# EAGLE schematic RPi-XBee-SMT (EAGLE 6.2)
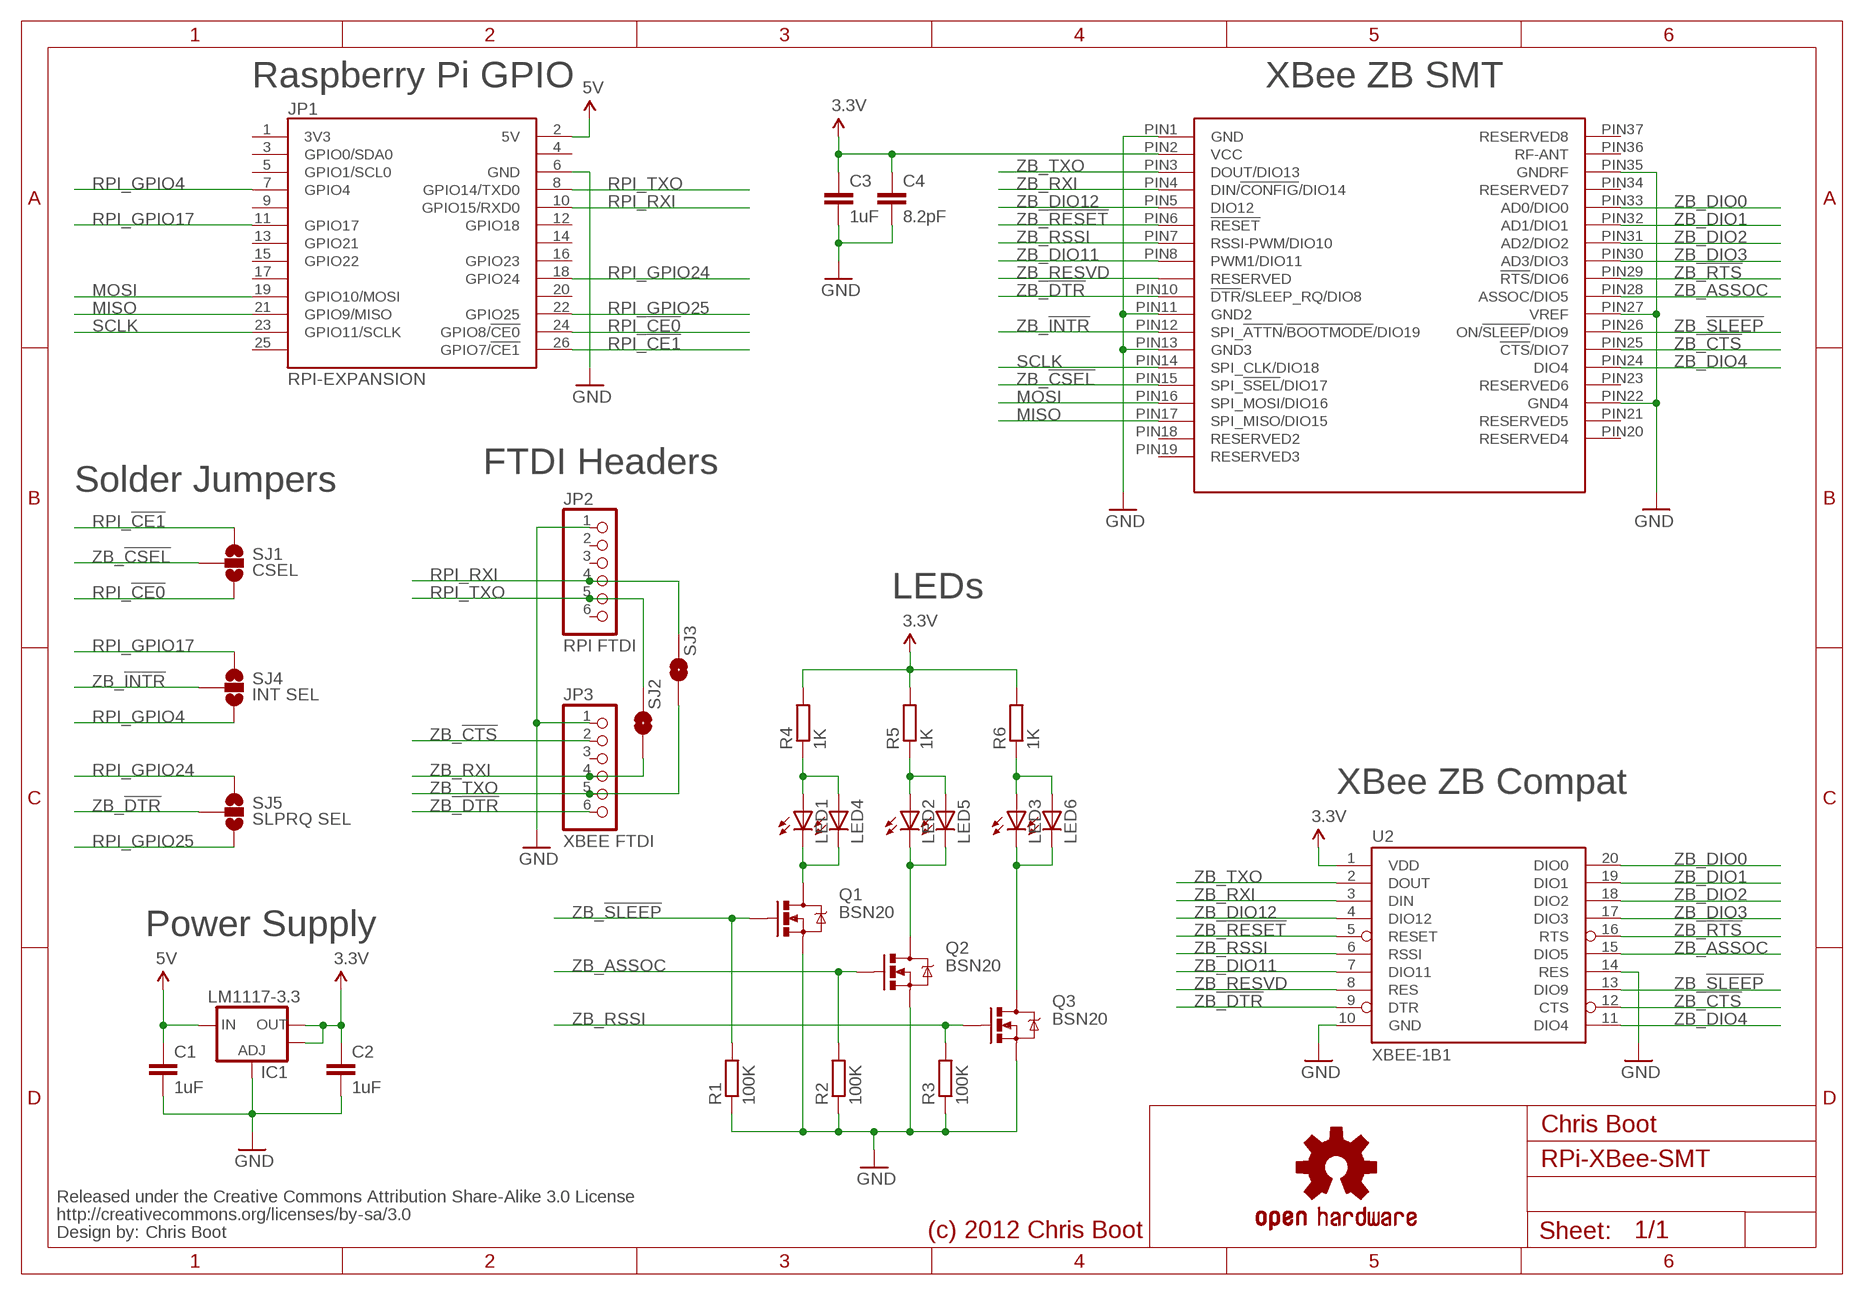
[diagram p0: schematic, sheet 1]

## Parts
C1  1uF  C-EUC0805  [C0805]
C2  1uF  C-EUC0805  [C0805]
C3  1uF  C-EUC0805  [C0805]
C4  8.2pF  C-EUC0805  [C0805]
IC1  LM1117-3.3  V_REG_LM1117SOT223  [SOT223]
JP1  RPI-EXPANSION  [2X13]
JP2  RPI FTDI  PINHD-1X6  [1X06]
JP3  XBEE FTDI  PINHD-1X6  [1X06]
LED1  LED-3MM-NO_SILK  [LED3MM-NS]
LED2  LED-3MM-NO_SILK  [LED3MM-NS]
LED3  LED-3MM-NO_SILK  [LED3MM-NS]
LED4  LED0603  [LED-0603]
LED5  LED0603  [LED-0603]
LED6  LED0603  [LED-0603]
Q1  BSN20  MOSFET-NCHANNELSMD  [SOT23-3]
Q2  BSN20  MOSFET-NCHANNELSMD  [SOT23-3]
Q3  BSN20  MOSFET-NCHANNELSMD  [SOT23-3]
R1  100K  R-EU_R0805  [R0805]
R2  100K  R-EU_R0805  [R0805]
R3  100K  R-EU_R0805  [R0805]
R4  1K  R-EU_R0805  [R0805]
R5  1K  R-EU_R0805  [R0805]
R6  1K  R-EU_R0805  [R0805]
SJ1  CSEL  SOLDERJUMPER_2WAYS  [SJ_3]
SJ2  SOLDERJUMPERNO  [SJ_2S-NO]
SJ3  SOLDERJUMPERNO  [SJ_2S-NO]
SJ4  INT SEL  SOLDERJUMPER_2WAYS  [SJ_3]
SJ5  SLPRQ SEL  SOLDERJUMPER_2WAYS  [SJ_3]
U1  QUBIQ_XBEE-SMT  [QUBIQ_FLAT-RF]
U2  XBEE-1B1  [XBEE-1]
U$3  CREATIVE_COMMONS  [CREATIVE_COMMONS]
U$4  OSHW-LOGOL  [OSHW-LOGO-L]

## Nets
3.3V: C2.1 C3.1 C4.1 IC1.2(OUT) IC1.4(OUT) R4.2 R5.2 R6.2 U1.PIN2(VCC) U2.1(VDD)
5V: C1.1 IC1.3(IN) JP1.2(5V)
GND: C1.2 C2.2 C3.2 C4.2 IC1.1(ADJ) JP1.6(GND) JP2.1 JP3.1 Q1.2(S) Q2.2(S) Q3.2(S) R1.1 R2.1 R3.1 U1.PIN1(GND) U1.PIN11(GND2) U1.PIN13(GND3) U1.PIN22(GND4) U1.PIN27(VREF) U1.PIN35(GNDRF) U2.10(GND) U2.14(RES)
MISO: JP1.21(GPIO9/MISO) U1.PIN17(SPI_MISO/DIO15)
MOSI: JP1.19(GPIO10/MOSI) U1.PIN16(SPI_MOSI/DIO16)
N$1: LED1.K(C) LED4.C Q1.3(D)
N$5: LED2.K(C) LED5.C Q2.3(D)
N$6: LED3.K(C) LED6.C Q3.3(D)
N$10: LED1.A LED4.A R4.1
N$12: LED2.A LED5.A R5.1
N$14: LED3.A LED6.A R6.1
RPI_!CE0: JP1.24(GPIO8/!CE0) SJ1.3
RPI_!CE1: JP1.26(GPIO7/!CE1) SJ1.1
RPI_GPIO4: JP1.7(GPIO4) SJ4.3
RPI_GPIO17: JP1.11(GPIO17) SJ4.1
RPI_GPIO24: JP1.18(GPIO24) SJ5.1
RPI_GPIO25: JP1.22(GPIO25) SJ5.3
RPI_RXI: JP1.10(GPIO15/RXD0) JP2.4 SJ3.2
RPI_TXO: JP1.8(GPIO14/TXD0) JP2.5 SJ2.2
SCLK: JP1.23(GPIO11/SCLK) U1.PIN14(SPI_CLK/DIO18)
ZB_!CSEL: SJ1.2 U1.PIN15(SPI_!SSEL!/DIO17)
ZB_!CTS: JP3.2 U1.PIN25(!CTS!/DIO7) U2.12(CTS)
ZB_!DTR: JP3.6 SJ5.2 U1.PIN10(!DTR!/SLEEP_RQ/DIO8) U2.9(DTR)
ZB_!INTR: SJ4.2 U1.PIN12(SPI_!ATTN!/!BOOTMODE!/DIO19)
ZB_!RESET: U1.PIN6(!RESET) U2.5(RESET)
ZB_!RTS: U1.PIN29(!RTS!/DIO6) U2.16(RTS)
ZB_!SLEEP: Q1.1(G) R1.2 U1.PIN26(ON/!SLEEP!/DIO9) U2.13(DIO9)
ZB_ASSOC: Q2.1(G) R2.2 U1.PIN28(ASSOC/DIO5) U2.15(DIO5)
ZB_DIO0: U1.PIN33(AD0/DIO0) U2.20(DIO0)
ZB_DIO1: U1.PIN32(AD1/DIO1) U2.19(DIO1)
ZB_DIO2: U1.PIN31(AD2/DIO2) U2.18(DIO2)
ZB_DIO3: U1.PIN30(AD3/DIO3) U2.17(DIO3)
ZB_DIO4: U1.PIN24(DIO4) U2.11(DIO4)
ZB_DIO11: U1.PIN8(PWM1/DIO11) U2.7(DIO11)
ZB_DIO12: U1.PIN5(DIO12) U2.4(DIO12)
ZB_RESVD: U1.PIN9(RESERVED) U2.8(RES)
ZB_RSSI: Q3.1(G) R3.2 U1.PIN7(RSSI-PWM/DIO10) U2.6(RSSI)
ZB_RXI: JP3.4 SJ2.1 U1.PIN4(DIN/!CONFIG!/DIO14) U2.3(DIN)
ZB_TXO: JP3.5 SJ3.1 U1.PIN3(DOUT/DIO13) U2.2(DOUT)
Unconnected: JP1.3(GPIO0/SDA0) JP1.4(NC0) JP1.5(GPIO1/SCL0) JP1.9(NC1) JP1.12(GPIO18) JP1.13(GPIO21) JP1.14(NC3) JP1.15(GPIO22) JP1.16(GPIO23) JP1.17(NC4) JP1.20(NC5) JP1.25(NC6) JP2.2 JP2.3 JP2.6 JP3.3 U1.PIN18(RESERVED2) U1.PIN19(RESERVED3) U1.PIN20(RESERVED4) U1.PIN21(RESERVED5) U1.PIN23(RESERVED6) U1.PIN34(RESERVED7) U1.PIN36(RF-ANT) U1.PIN37(RESERVED8)

## Notes on the sheet
- Raspberry Pi GPIO | XBee ZB SMT
- FTDI Headers
- Solder Jumpers
- LEDs
- XBee ZB Compat
- Power Supply
- Chris Boot
- Chris Boot | (c) 2012 Chris Boot

## Power pins joined to a net without a drawn wire
3V3: JP1.1(3V3)

## Library data of the parts
C1-C4 = resistor:C-EU: CAPACITOR, European symbol
IC1 = SparkFun-PowerIC:V_REG_LM1117: Voltage Regulator LM1117 Standard adjustable voltage regulator but in SMD form. Spark Fun Electronics SKU : COM-00595
JP1 = raspberrypi:RPI-EXPANSION
JP2 JP3 = custom:PINHD-1X6: PIN HEADER
LED1-LED6 = SparkFun-LED:LED: LEDs Standard schematic elements and footprints for 5mm, 3mm, 1206, and 0603 sized LEDs. 5mm - Spark Fun Electronics SKU : COM-00529 (and others)
Q1-Q3 = SparkFun-DiscreteSemi:MOSFET-NCHANNEL: Generic NMOS footprint
R1-R6 = resistor:R-EU_: RESISTOR, European symbol
SJ1 SJ4 SJ5 = SparkFun-Passives:SOLDERJUMPER_2WAY: Solder Jumper 2 way solder jumper
SJ2 SJ3 = SparkFun-Passives:SOLDERJUMPER: Solder Jumper Standard SMD solder jumper. Used to automate production. Two varients : Normally Open and Normally Closed are the same, but have different paste layers. NC will have a large amount of paste and should jumper during reflow.
U1 = xbee-smt:QUBIQ_XBEE-SMT
U2 = SparkFun-RF:XBEE-1: Xbee module footprints
U$3 = SparkFun-Aesthetics:CREATIVE_COMMONS: Creative Commons License summary
U$4 = SparkFun-Aesthetics:OSHW-LOGO: Open Source Hardware Logo This logo indicates the piece of hardware it is found on incorporates a OSHW license and/or adheres to the definition of open source hardware found here: http://freedomdefined.org/OSHW